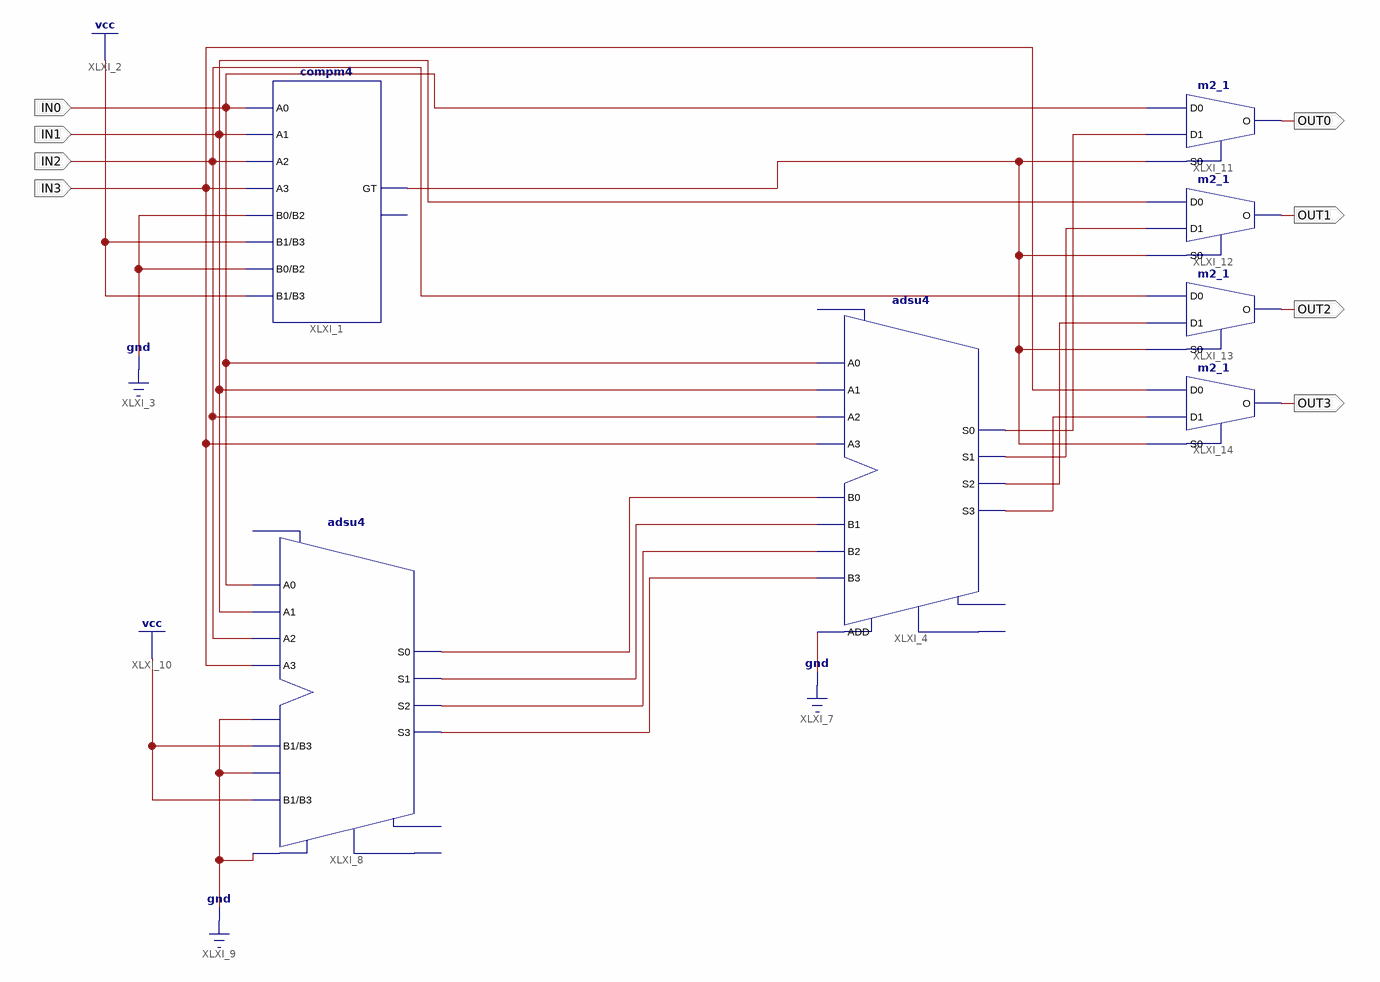
[diagram p0: schematic sheet 1]
// Xilinx ISE schematic mod10.sch (spartan3) as structural Verilog: 7 symbols, 8 ports
module mod10 (
  input  IN0,
  input  IN1,
  input  IN2,
  input  IN3,
  output OUT0,
  output OUT1,
  output OUT2,
  output OUT3
);

  wire XLXN_38, XLXN_39, XLXN_40, XLXN_41, XLXN_46, XLXN_49, XLXN_50, XLXN_51, XLXN_52;

  compm4 XLXI_1 (
    .A0(IN0), .A1(IN1), .A2(IN2), .A3(IN3), .B0(1'b0), .B1(1'b1), .B2(1'b0), .B3(1'b1), .GT(XLXN_46));  // open: LT
  adsu4 XLXI_4 (
    .A0(IN0), .A1(IN1), .A2(IN2), .A3(IN3), .ADD(1'b0), .B0(XLXN_38), .B1(XLXN_39), .B2(XLXN_40),
    .B3(XLXN_41), .S0(XLXN_49), .S1(XLXN_50), .S2(XLXN_51), .S3(XLXN_52));  // open: CI, CO, OFL
  adsu4 XLXI_8 (
    .A0(IN0), .A1(IN1), .A2(IN2), .A3(IN3), .ADD(1'b0), .B0(1'b0), .B1(1'b1), .B2(1'b0), .B3(1'b1),
    .S0(XLXN_38), .S1(XLXN_39), .S2(XLXN_40), .S3(XLXN_41));  // open: CI, CO, OFL
  m2_1 XLXI_11 (.D0(IN0), .D1(XLXN_49), .S0(XLXN_46), .O(OUT0));
  m2_1 XLXI_12 (.D0(IN1), .D1(XLXN_50), .S0(XLXN_46), .O(OUT1));
  m2_1 XLXI_13 (.D0(IN2), .D1(XLXN_51), .S0(XLXN_46), .O(OUT2));
  m2_1 XLXI_14 (.D0(IN3), .D1(XLXN_52), .S0(XLXN_46), .O(OUT3));
endmodule
